# EAGLE design PDB (EAGLE 9.6.2)
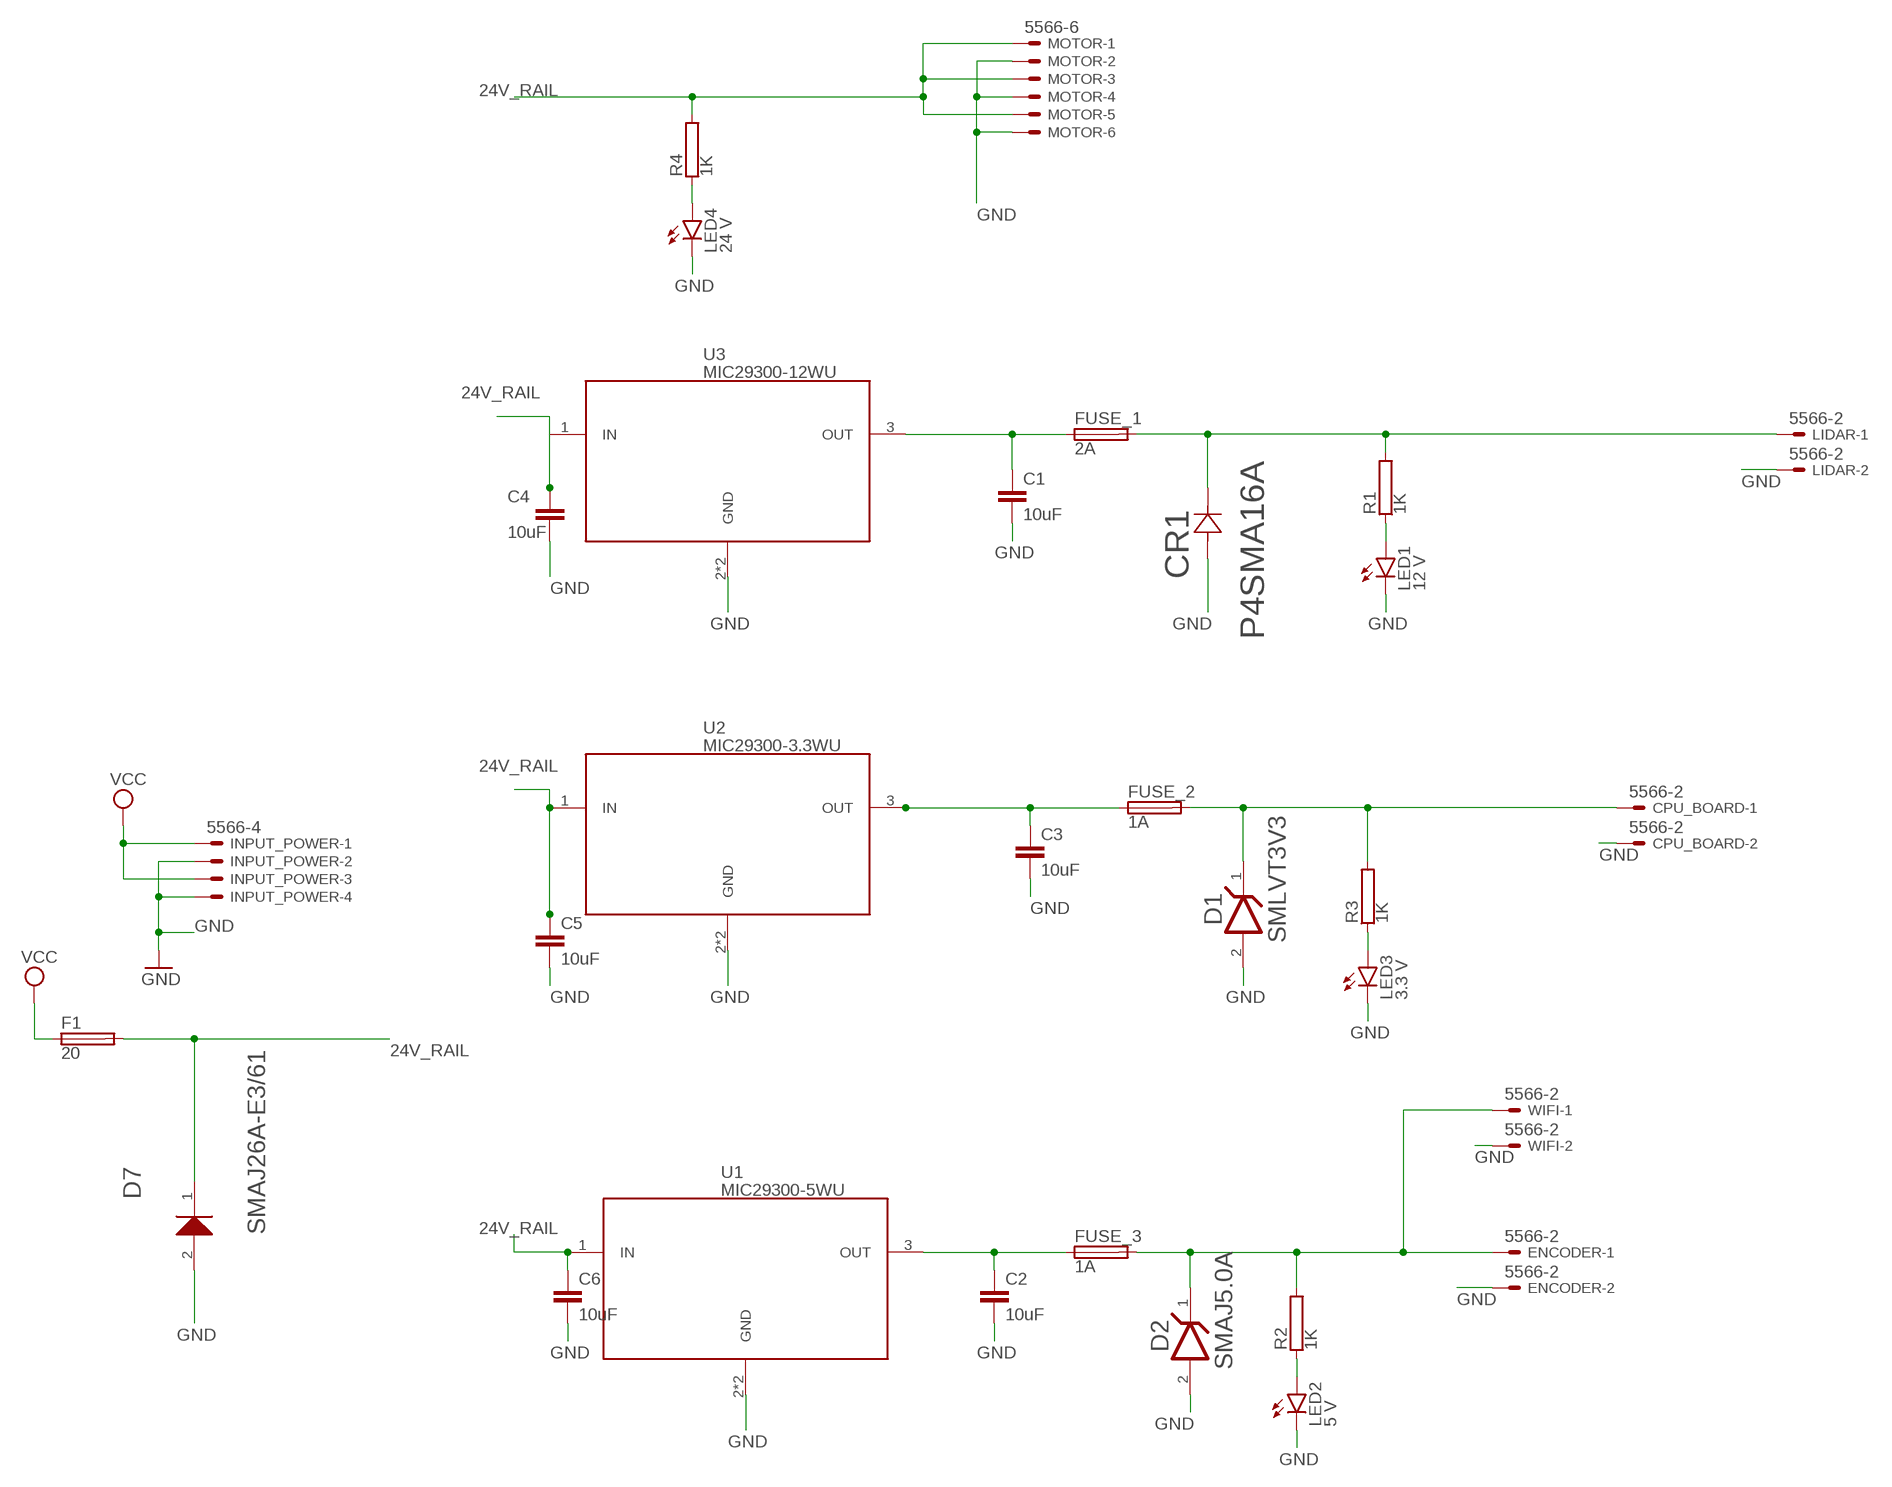
[diagram p0: schematic, sheet 1]

## Parts
C1  10uF  C2.5/2  [C2.5-2]
C2  10uF  C2.5/2  [C2.5-2]
C3  10uF  C2.5/2  [C2.5-2]
C4  10uF  C2.5/2  [C2.5-2]
C5  10uF  C2.5/2  [C2.5-2]
C6  10uF  C2.5/2  [C2.5-2]
CPU_BOARD  5566-2  [5566-2]
CR1  P4SMA16A  [P4SMASERIES_LTF]
D1  STMICROELECTRONICS_SMLVT3V3STMICROELECTRONICS_SMLVT3V3_0_0  [STMICROELECTRONICS_SMLVT3V3_0]
D2  LITTELFUSE_INC._SMAJ5.0ALITTELFUSE_INC._SMAJ5.0A_0_0  [LITTELFUSE_INC._SMAJ5.0A_0]
D7  VISHAY_SEMICONDUCTOR_SMAJ26A-E3-61VISHAY_SEMICONDUCTOR_SMAJ26A-E3-61_0_0  [VISHAY_SEMICONDUCTOR_SMAJ26A-E3-61_0]
ENCODER  5566-2  [5566-2]
F1  20  TE5  [TE5]
FUSE_1  2A  TE5  [TE5]
FUSE_2  1A  TE5  [TE5]
FUSE_3  1A  TE5  [TE5]
INPUT_POWER  5566-4  [5566-4]
LED1  12 V  LEDCHIPLED_0805  [CHIPLED_0805]
LED2  5 V  LEDCHIPLED_0805  [CHIPLED_0805]
LED3  3.3 V  LEDCHIPLED_0805  [CHIPLED_0805]
LED4  24 V  LEDCHIPLED_0805  [CHIPLED_0805]
LIDAR  5566-2  [5566-2]
MOTOR  5566-6  [5566-6]
R1  1K  RMG100-V  [TO-247-2V]
R2  1K  RMG100-V  [TO-247-2V]
R3  1K  RMG100-V  [TO-247-2V]
R4  1K  RMG100-V  [TO-247-2V]
U1  MIC29300-5WU  [TO263]
U2  MIC29300-3.3WU  [TO263]
U3  MIC29300-12WU  [TO263]
WIFI  5566-2  [5566-2]

## Nets
24V_RAIL: C4.1 C5.1 C6.1 D7.1(K) F1.2 MOTOR.1 MOTOR.3 MOTOR.5 R4.2 U1.1(IN) U2.1(IN) U3.1(IN)
GND: C1.2 C2.2 C3.2 C4.2 C5.2 C6.2 CPU_BOARD.2 CR1.2 D1.2(A) D2.2(ANODE) D7.2(A) ENCODER.2 INPUT_POWER.2 INPUT_POWER.4 LED1.C LED2.C LED3.C LED4.C LIDAR.2 MOTOR.2 MOTOR.4 MOTOR.6 U1.2(GND) U1.GND@(GND) U2.2(GND) U2.GND@(GND) U3.2(GND) U3.GND@(GND) WIFI.2
N$1: C1.1 FUSE_1.1 U3.3(OUT)
N$2: LED4.A R4.1
N$3: C2.1 FUSE_3.1 U1.3(OUT)
N$4: C3.1 FUSE_2.1 U2.3(OUT)
N$5: CPU_BOARD.1 D1.1(K) FUSE_2.2 R3.2
N$6: D2.1(CATHODE) ENCODER.1 FUSE_3.2 R2.2 WIFI.1
N$7: CR1.1 FUSE_1.2 LIDAR.1 R1.2
N$8: LED1.A R1.1
N$9: LED3.A R3.1
N$10: LED2.A R2.1
VCC: F1.1 INPUT_POWER.1 INPUT_POWER.3

## Library data of the parts
C1-C6 = capacitor-wima:C: CAPACITOR naming: grid - package width
CPU_BOARD ENCODER LIDAR WIFI = con-molex:5566-2: Mini FIT connector 2 pol Source: http://www.molex.com; MF: MOLEX; OC_FARNELL: 1822072; OC_NEWARK: unknown
CR1 = P4SMA_16A:P4SMA16A; COPYRIGHT: Copyright (C) 2022 Ultra Librarian. All rights reserved.; DIGI-KEY_PART_NUMBER_1: 283-P4SMA16ATR-ND; DIGI-KEY_PART_NUMBER_2: 2997-P4SMA16ATR-ND; DIGI-KEY_PART_NUMBER_3: P4SMA16ABBCT-ND; DIGI-KEY_PART_NUMBER_4: P4SMA16ABBDKR-ND; DIGI-KEY_PART_NUMBER_5: P4SMA16ABBTR-ND; DIGI-KEY_PART_NUMBER_6: P4SMA16ACT-ND; DIGI-KEY_PART_NUMBER_7: P4SMA16ADKR-ND; DIGI-KEY_PART_NUMBER_8: P4SMA16ATR-ND; MANUFACTURER_PART_NUMBER: P4SMA16A; MFR_NAME: Littelfuse Inc
D1 = STMicroelectronics - SMLVT3V3:STMICROELECTRONICS_SMLVT3V3: 10.3V Clamp 200A (8/20µs) Ipp Tvs Diode Surface Mount SMB (DO-214AA); AUTOMOTIVE: No; BREAKDOWN_VOLTAGE: 4.1V; CAPACITANCE: 5200pF; CENTROID_NOT_SPECIFIED: No; CLAMPING_VOLTAGE: 7.3V; DATASHEET: https://www.st.com/resource/en/datasheet/smlvt3v3.pdf; DEVICE_CLASS_L1: Circuit Protection; DEVICE_CLASS_L2: TVS Diodes; DEVICE_CLASS_L3: unset; DIGIKEY_DESCRIPTION: DIODE TVS DIODE 3.3V 10.3V SMB; DIGIKEY_PART_NUMBER: 497-2496-1-ND; DIRECTION: Unidirectional; FOOTPRINT_VARIANT_NAME_0: Recommended_Land_Pattern; HEIGHT: 2.65mm; LEAD_FREE: Yes; MAX_JUNCTION_TEMP: +175°C; MF: STMicroelectronics; MFG_PACKAGE_IDENT: SMB; MFG_PACKAGE_IDENT_DATE: 0; MFG_PACKAGE_IDENT_REV: 0; MOUSER_DESCRIPTION: TVS Diodes - Transient Voltage Suppressors 600W 3.3V Unidirect; MOUSER_PART_NUMBER: 511-SMLVT3V3; MPN: SMLVT3V3; NUMBER_OF_CHANNELS: 1; PACKAGE: SMB; PEAK_PULSE_CURRENT: 50A; PEAK_PULSE_POWER: 600W; PREFIX: D; ROHS: Yes; STANDOFF_HEIGHT: 0.05mm; TEMPERATURE_RANGE_HIGH: +175°C; TEMPERATURE_RANGE_LOW: -55°C; VERIFICATION_VERSION: 0.0.0.3
D2 = Littelfuse Inc. - SMAJ5.0A:LITTELFUSE_INC._SMAJ5.0A: Transient Voltage Suppression Diodes; CENTROID_NOT_SPECIFIED: No; CLAMPING_VOLTAGE: 9.2V; DATASHEET: http://www.littelfuse.com/~/media/electronics/datasheets/tvs_diodes/littelfuse_tvs_diode_smaj_datasheet.pdf.pdf; DEVICE_CLASS_L1: Circuit Protection; DEVICE_CLASS_L2: TVS Diodes; DEVICE_CLASS_L3: unset; DIGIKEY_DESCRIPTION: DIODE TVS DIODE 5V 9.2V DO214AC; DIGIKEY_PART_NUMBER: SMAJ5.0ALFCT-ND; DIRECTION: Unidirectional; HEIGHT: 2.29mm; LEAD_FREE: yes; MAX_JUNCTION_TEMP: +150°C; MF: Littelfuse Inc.; MFG_PACKAGE_IDENT: SMAJ; MFG_PACKAGE_IDENT_DATE: 0; MFG_PACKAGE_IDENT_REV: 0; MOUSER_DESCRIPTION: SMAJ Series 9.2 V 400 W Surface Mount Uni-Directional TVS Diode - DO-214AC; MOUSER_PART_NUMBER: 576-SMAJ5.0A; MPN: SMAJ5.0A; PACKAGE: DO-214AC; PEAK_PULSE_CURRENT: 43.5A; PREFIX: D; REVERSE_STANDOFF_VOLTAGE: 5V; ROHS: yes; STANDOFF_HEIGHT: 0.203mm; TEMPERATURE_RANGE_HIGH: +150°C; TEMPERATURE_RANGE_LOW: -65°C; VERIFICATION_VERSION: 0.0.0.1
D7 = SMAJ:VISHAY_SEMICONDUCTOR_SMAJ26A-E3-61: VISH-K1A2-2; CIIVA_IDS: 3122016; COMPONENT_LINK_1_DESCRIPTION: Manufacturer URL; COMPONENT_LINK_1_URL: http://www.vishay.com/; COMPONENT_LINK_3_DESCRIPTION: Package Specification; COMPONENT_LINK_3_URL: http://www.vishay.com/docs/88390/smaj50a.pdf; DATASHEET: http://www.vishay.com/docs/88390/smaj50a.pdf; DATASHEET_VERSION: 12/8/2013; FOOTPRINT_VARIANT_NAME_0: Level C; FOOTPRINT_VARIANT_NAME_1: Level B; FOOTPRINT_VARIANT_NAME_2: Level A; ID_UA: 1; IFSM: 40 A; IMPORTED: yes; IMPORTED_FROM: vault; IMPORT_TS: 1521861421; MF: Vishay Semiconductor; MOUNTING_TECHNOLOGY: Surface Mount; MPN: SMAJ26A-E3/61; OPERATING_JUNCTION_AND_STORAGE_TEMPERATURE_RANGE: -55 to 150 degC; PACKAGE: DO-214AC-2; PACKAGE_DESCRIPTION: 2-Pin DO-214AC (SMA), Body 4.245 x 2.665 mm; PACKING: Tape and Reel; PPPM_W: 400, 300; PREFIX: D; RELEASE_DATE: 1384933640; ROHS: Yes; VAULT_GUID: AD317694-DE0E-4C26-89D2-23B1414C378E; VAULT_REVISION: 6B730A9C-908D-494C-BC28-14F9434F73E3; VBR_UNI_DIRECTIONAL_V: 6.4 to 231; VWM_V: 26
F1 FUSE_1-FUSE_3 = fuse:TE5: FUSE Wickmann; OC_FARNELL: unknown; OC_NEWARK: unknown
INPUT_POWER = con-molex:5566-4: Mini FIT connector 4 pol Source: http://www.molex.com; MF: MOLEX; OC_FARNELL: unknown; OC_NEWARK: unknown
LED1-LED4 = led:LED: LED OSRAM: - CHIPLED LG R971, LG N971, LY N971, LG Q971, LY Q971, LO R971, LY R971 LH N974, LH R974 LS Q976, LO Q976, LY Q976 LO Q996 - Hyper CHIPLED LW Q18S LB Q993, LB Q99A, LB R99A - SideLED LS A670, LO A670, LY A670, LG A670, LP A670 LB A673, LV A673, LT A673, LW A673 LH A674 LY A675 LS A676, LA A676, LO A676, LY A676, LW A676 LS A679, LY A679, LG A679 - Hyper Micro SIDELED® LS Y876, LA Y876, LO Y876, LY Y876 LT Y87S - SmartLED LW L88C, LW L88S LB L89C, LB L89S, LG L890 LS L89K, LO L89K, LY L89K LS L896, LA L896, LO L896, LY L896 - TOPLED LS T670, LO T670, LY T670, LG T670, LP T670 LSG T670, LSP T670, LSY T670, LOP T670, LYG T670 LG T671, LOG T671, LSG T671 LB T673, LV T673, LT T673, LW T673 LH T674 LS T676, LA T676, LO T676, LY T676, LB T676, LH T676, LSB T676, LW T676 LB T67C, LV T67C, LT T67C, LS T67K, LO T67K, LY T67K, LW E67C LS E67B, LA E67B, LO E67B, LY E67B, LB E67C, LV E67C, LT E67C LW T67C LS T679, LY T679, LG T679 LS T770, LO T770, LY T770, LG T770, LP T770 LB T773, LV T773, LT T773, LW T773 LH T774 LS E675, LA E675, LY E675, LS T675 LS T776, LA T776, LO T776, LY T776, LB T776 LHGB T686 LT T68C, LB T68C - Hyper Mini TOPLED® LB M676 - Mini TOPLED Santana® LG M470 LS M47K, LO M47K, LY M47K Source: http://www.osram.convergy.de LUXEON: - LUMILED® LXK2-PW12-R00, LXK2-PW12-S00, LXK2-PW14-U00, LXK2-PW14-V00 LXK2-PM12-R00, LXK2-PM12-S00, LXK2-PM14-U00 LXK2-PE12-Q00, LXK2-PE12-R00, LXK2-PE12-S00, LXK2-PE14-T00, LXK2-PE14-U00 LXK2-PB12-K00, LXK2-PB12-L00, LXK2-PB12-M00, LXK2-PB14-N00, LXK2-PB14-P00, LXK2-PB14-Q00 LXK2-PR12-L00, LXK2-PR12-M00, LXK2-PR14-Q00, LXK2-PR14-R00 LXK2-PD12-Q00, LXK2-PD12-R00, LXK2-PD12-S00 LXK2-PH12-R00, LXK2-PH12-S00 LXK2-PL12-P00, LXK2-PL12-Q00, LXK2-PL12-R00 Source: www.luxeon.com KINGBRIGHT: KA-3528ASYC Source: www.kingbright.com
MOTOR = con-molex:5566-6: Mini FIT connector 6 pol Source: http://www.molex.com; MF: MOLEX; MPN: 95566-61002; OC_FARNELL: unknown; OC_NEWARK: 22K8620
R1-R4 = resistor-power:RMG100: TO-247 Power Resistor - RMG 100 Series Source: www.token.com.tw .. power-resistor-rmg100pdf; OC_FARNELL: unknown; OC_NEWARK: unknown
U1 = MIC29300:MIC29300-5WU: Check availability <https://pricing.snapeda.com/parts/MIC29300-12WU/Microchip%20Technology/view-part?ref=eda>; AVAILABILITY: In Stock; DESCRIPTION: Linear Voltage Regulator IC Positive Fixed 1 Output 3A TO-263-3; MF: Microchip Technology; MP: MIC29300-5WU; PACKAGE: None; PRICE: None; PURCHASE-URL: https://pricing.snapeda.com/search/part/MIC29300-12WU/?ref=eda
U2 = MIC29300:MIC29300-3.3WU: Check availability <https://pricing.snapeda.com/parts/MIC29300-12WU/Microchip%20Technology/view-part?ref=eda>; AVAILABILITY: In Stock; DESCRIPTION: Linear Voltage Regulator IC Positive Fixed 1 Output 3A TO-263-3; MF: Microchip Technology; MP: MIC29300-3.3WU; PACKAGE: None; PRICE: None; PURCHASE-URL: https://pricing.snapeda.com/search/part/MIC29300-12WU/?ref=eda
U3 = MIC29300:MIC29300-12WU: Check availability <https://pricing.snapeda.com/parts/MIC29300-12WU/Microchip%20Technology/view-part?ref=eda>; AVAILABILITY: In Stock; DESCRIPTION: Linear Voltage Regulator IC Positive Fixed 1 Output 3A TO-263-3; MF: Microchip Technology; MP: MIC29300-12WU; PACKAGE: None; PRICE: None; PURCHASE-URL: https://pricing.snapeda.com/search/part/MIC29300-12WU/?ref=eda

## Board
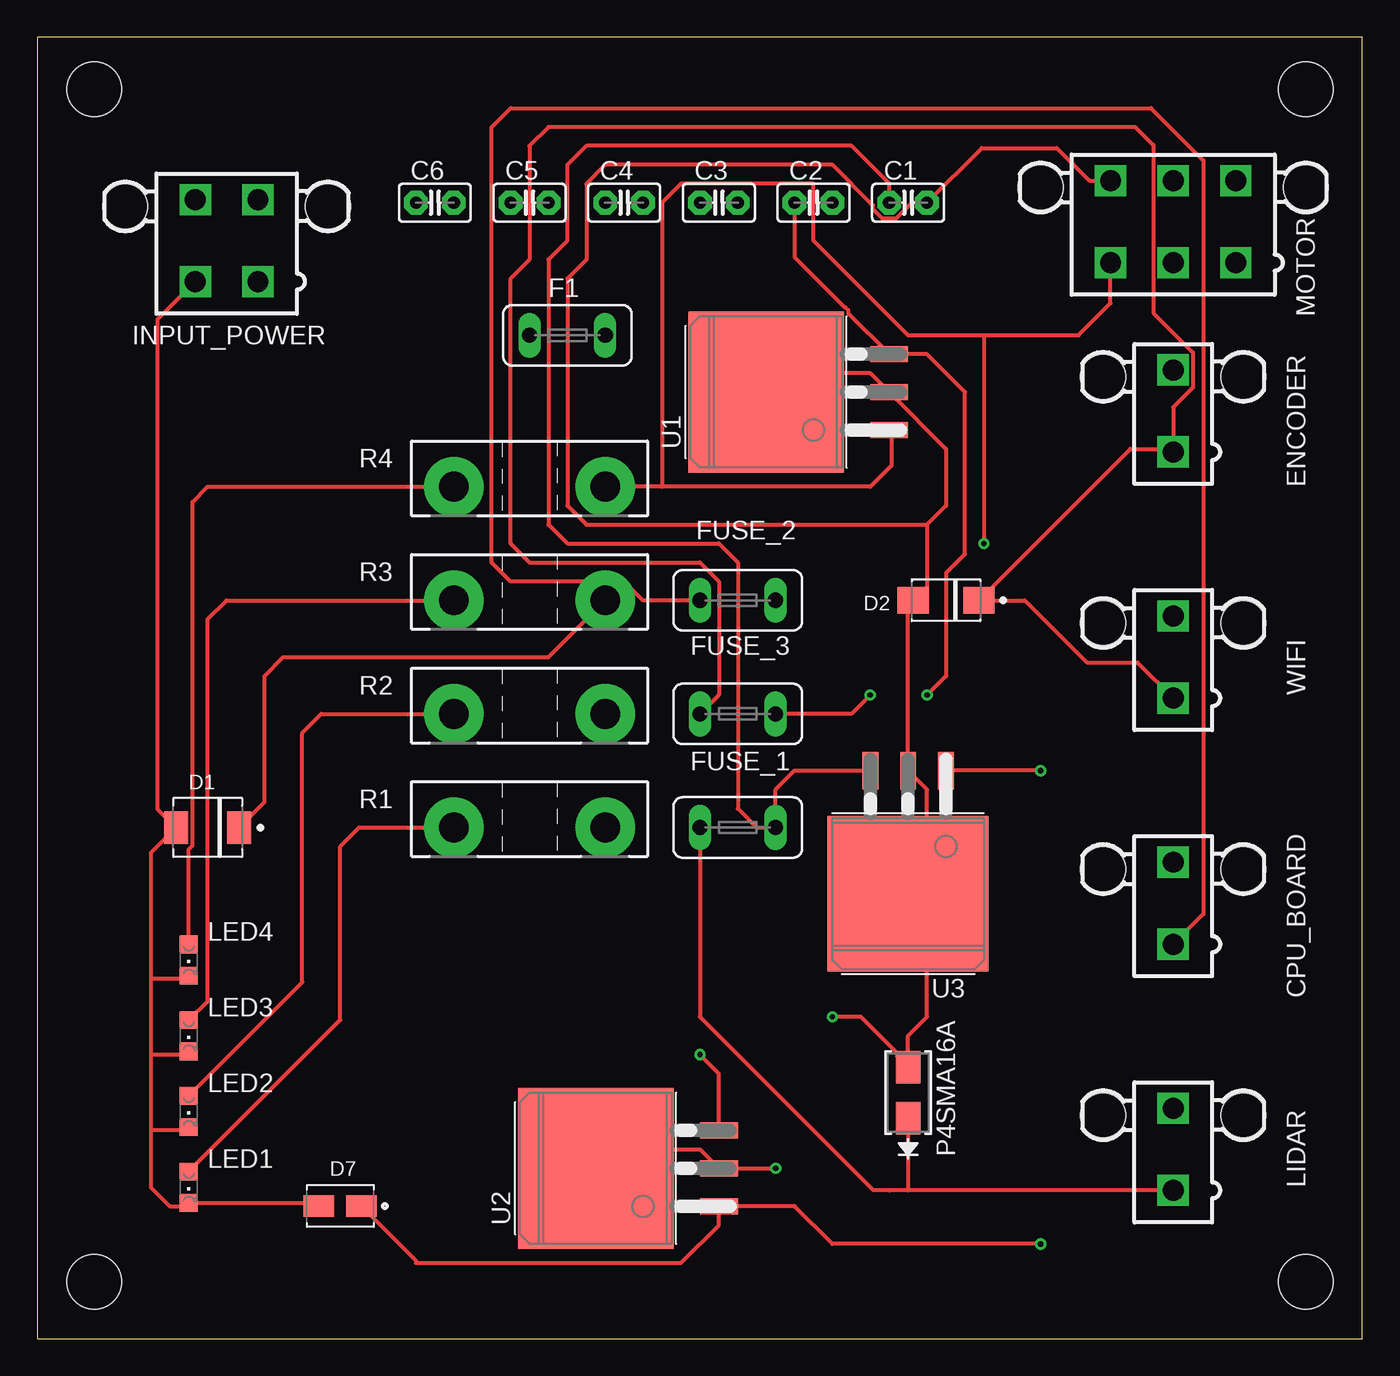
[diagram p1: board, top side]
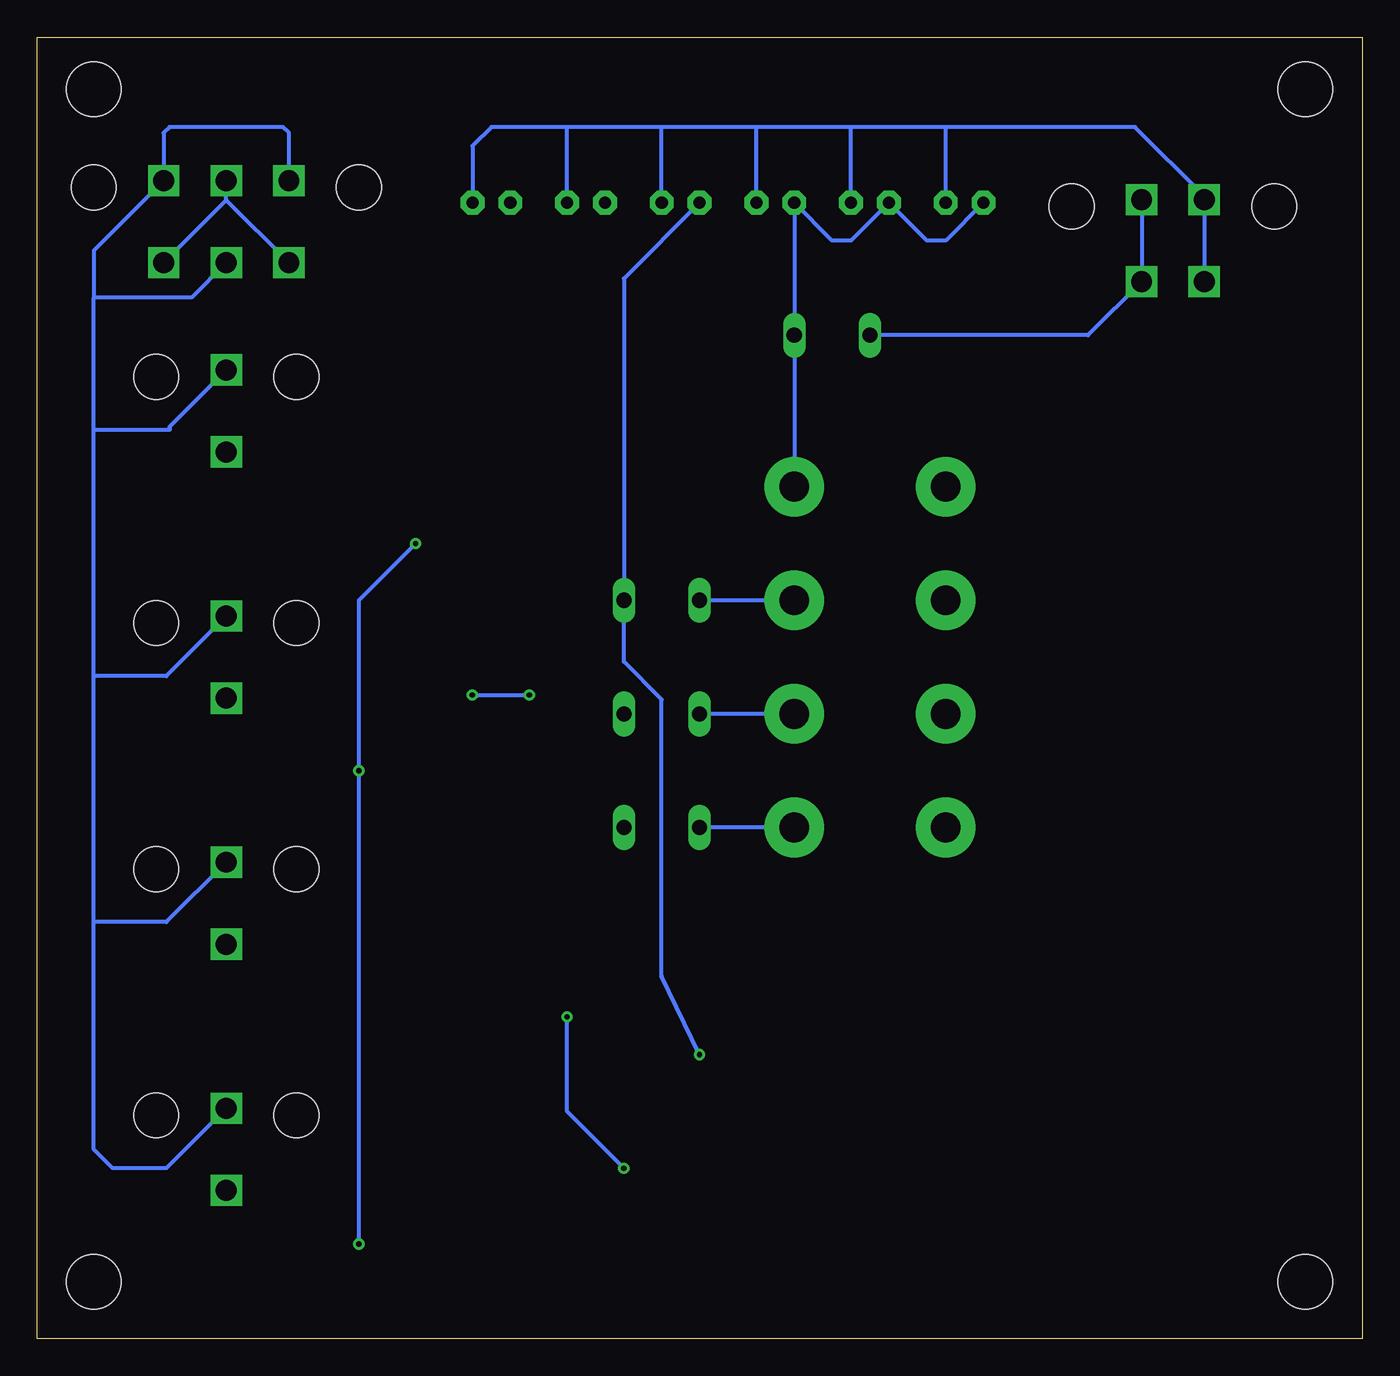
[diagram p2: board, bottom side, seen from below]

Size 88.88 x 87.3 mm. Coordinates in mm from the lower left corner, seen from the top.
Outline: 0,0 88.88,0 88.88,87.3 0,87.3 0,0
Copper layers (1*16): Top 0.035mm / dielectric 1.5mm / Bottom 0.035mm
Design rules "default": minimum track width 6mil, minimum drill 0.35mm, track to track 6mil, track to pad 6mil, pad to pad 6mil, via to via 6mil, smd to smd 6mil, copper to edge 40mil, drill to drill 6mil, minimum pad ring 10mil, minimum via ring 8mil, stop-mask expansion 4mil, vias tented up to drill 0mil, thermal gap 10mil
Holes 3.66 mm at 3.81,3.81 3.81,83.82 85.09,83.82 85.09,3.81

### Footprints (pad centres in the part's own frame; a part is rotated, then mirrored left to right if it is on the bottom)
C2.5-2 = drill 0.813 pad 1.6 octagon: 1 -1.27,0; 2 1.27,0
5566-2 = drill 1.4 square: 1 0,-2.75; 2 0,2.75 | hole 3: 4.7,2.29; -4.7,2.29
P4SMASERIES_LTF = smd 2.184 x 1.651: 1 -1.702,0; 2 1.702,0
STMICROELECTRONICS_SMLVT3V3_0 = smd 1.62 x 2.18: 1 -2.11,0; 2 2.11,0
LITTELFUSE_INC._SMAJ5.0A_0 = smd 2.1 x 1.8: 1 -2.2,0; 2 2.2,0
VISHAY_SEMICONDUCTOR_SMAJ26A-E3-61_0 = smd 2.05 x 1.45: 1 -1.425,0; 2 1.425,0
TE5 = drill 1.016 long: 1 -2.54,0; 2 2.54,0
5566-4 = drill 1.4 square: 1 2.1,-2.75; 2 -2.1,-2.75; 3 2.1,2.75; 4 -2.1,2.75 | hole 3: 6.8,2.29; -6.8,2.29
CHIPLED_0805 = smd 1.2 x 1.2: A 0,-1.05; C 0,1.05
5566-6 = drill 1.4 square: 1 4.2,-2.75; 2 0,-2.75; 3 -4.2,-2.75; 4 4.2,2.75; 5 0,2.75; 6 -4.2,2.75 | hole 3: 8.9,2.29; -8.9,2.29
TO-247-2V = drill 2 pad 4: 1 -5.08,0; 2 5.08,0
TO263 = smd 1.067 x 2.54: 1 -2.54,0; 2 0,0; 3 2.54,0 | smd 10.795 x 10.414: GND@ 0,8.255

### Placement (x,y rotation side)
C1  58.42,76.2 0 top
C2  52.07,76.2 0 top
C3  45.72,76.2 0 top
C4  39.37,76.2 0 top
C5  33.02,76.2 0 top
C6  26.67,76.2 0 top
CPU_BOARD  76.2,29.21 0 top
CR1  58.42,16.51 90 top
D1  11.43,34.29 180 top
D2  60.96,49.53 180 top
D7  20.32,8.89 180 top
ENCODER  76.2,62.23 0 top
F1  35.56,67.31 0 top
FUSE_1  46.99,34.29 180 top
FUSE_2  46.99,49.53 180 top
FUSE_3  46.99,41.91 180 top
INPUT_POWER  12.7,73.66 0 top
LED1  10.16,10.16 180 top
LED2  10.16,15.24 180 top
LED3  10.16,20.32 180 top
LED4  10.16,25.4 180 top
LIDAR  76.2,12.7 0 top
MOTOR  76.2,74.93 0 top
R1  33.02,34.29 0 top
R2  33.02,41.91 0 top
R3  33.02,49.53 0 top
R4  33.02,57.15 0 top
U1  57.15,63.5 90 top
U2  45.72,11.43 90 top
U3  58.42,38.1 180 top
WIFI  76.2,45.72 0 top

### Tracks (layer width: path | path; a pad name or v marks a point on that pad's centre or on a via)
24V_RAIL  (via drill 0.35)
  Top 0.254: 41.91,57.15 55.88,57.15 57.31,58.59 57.31,60.8 U1.1 | 41.91,57.15 R4.2 | 63.5,67.31 v63.5,53.34 | 63.5,67.31 58.42,67.31 52.07,73.66 52.07,77.47 43.18,77.47 41.91,76.2 41.91,57.15 | 63.5,67.31 69.85,67.31 72,69.46 MOTOR.3 | D7.1 25.4,5.24 25.4,5.08 43.18,5.08 45.72,7.62 U2.1 50.8,8.89 53.34,6.35 v67.31,6.35 | v67.31,38.1 U3.1
  Bottom 0.254: MOTOR.1 76.2,76.38 | 76.2,76.38 MOTOR.5 | MOTOR.3 76.2,76.38 | R4.2 F1.2 C4.1 35.56,73.66 34.29,73.66 C5.1 29.21,73.66 27.94,73.66 C6.1 | v63.5,53.34 67.31,49.53 v67.31,38.1 v67.31,6.35
GND  (via drill 0.35)
  Top 0.254: INPUT_POWER.2 8.06,68.37 8.06,35.55 D1.2 7.62,32.59 7.62,24.13 | 7.62,13.97 7.62,10.16 8.89,8.89 9.94,8.89 LED1.C 18.68,9.11 D7.2 | 7.62,24.13 7.62,19.05 | 7.62,19.05 7.62,13.97 | LED2.C 9.94,13.97 7.62,13.97 | LED3.C 9.94,19.05 7.62,19.05 | LED4.C 9.94,24.13 7.62,24.13 | 59.69,54.61 60.96,55.88 60.96,59.69 U1.2 55.88,64.77 50.16,64.77 U1.GND@ | 59.69,54.61 59.69,50.46 D2.2 58.42,49.19 U3.2 59.69,36.83 59.69,30.48 | 59.69,54.61 36.83,54.61 35.56,55.88 35.56,71.12 36.83,72.39 36.83,77.47 38.1,78.74 53.34,78.74 56.07,76.01 56.07,75.75 56.7,75.12 57.6,75.12 58.68,76.2 C1.2 63.35,79.86 68.39,79.86 70.58,77.68 MOTOR.6 | 59.69,30.48 59.69,21.59 58.42,20.32 CR1.2 57.68,18.95 57.68,19.16 55.25,21.59 v53.34,21.59 | U3.GND@ 59.05,30.48 59.69,30.48 | v49.53,11.43 U2.2 44.45,12.7 38.1,12.7 38.1,12.06 U2.GND@
  Bottom 0.254: MOTOR.6 72,80.89 72.39,81.28 80.01,81.28 80.4,80.89 MOTOR.4 85.09,72.99 85.09,69.85 | MOTOR.2 78.53,69.85 85.09,69.85 | 85.09,60.96 85.09,69.85 | WIFI.2 80.22,44.45 85.09,44.45 | 85.09,44.45 85.09,60.96 | CPU_BOARD.2 80.22,27.94 85.09,27.94 | 85.09,27.94 85.09,44.45 | LIDAR.2 80.22,11.43 83.82,11.43 85.09,12.7 85.09,27.94 | 27.94,81.28 15.24,81.28 10.6,76.64 INPUT_POWER.4 INPUT_POWER.2 | 27.94,81.28 34.29,81.28 | 34.29,81.28 40.64,81.28 | 40.64,81.28 46.99,81.28 | 46.99,81.28 53.34,81.28 | 53.34,81.28 58.42,81.28 59.69,80.01 C1.2 | C2.2 53.34,81.28 | C3.2 46.99,81.28 | C4.2 40.64,81.28 | C5.2 34.29,81.28 | C6.2 27.94,81.28 | ENCODER.2 80.01,61.17 80.01,60.96 85.09,60.96 | v49.53,11.43 53.34,15.24 v53.34,21.59
N$1
  Top 0.254: U3.3 50.8,38.1 49.53,36.83 FUSE_1.1 48.26,34.29 46.99,35.56 46.99,52.07 45.72,53.34 35.56,53.34 34.29,54.61 34.29,72.39 35.56,73.66 35.56,78.74 36.83,80.01 54.61,80.01 57.15,77.47 C1.1
N$2
  Top 0.254: LED4.A 10.16,32.84 10.41,33.08 10.41,56.13 11.43,57.15 R4.1
N$3  (via drill 0.35)
  Top 0.254: C2.1 50.8,72.56 54.18,69.18 54.22,69.18 54.38,69.01 54.38,68.81 U1.3 59.69,66.04 62.23,63.5 62.23,52.65 60.96,51.38 60.96,44.45 v59.69,43.18 | v55.88,43.18 54.61,41.91 FUSE_3.1
  Bottom 0.254: v59.69,43.18 v55.88,43.18
N$4  (via drill 0.35)
  Top 0.254: v44.45,19.05 45.72,17.78 U2.3
  Bottom 0.254: C3.1 49.53,71.12 FUSE_2.1 49.53,45.41 46.99,42.88 46.99,24.31 v44.45,19.05
N$5
  Top 0.254: D1.1 15.24,35.99 15.24,44.45 16.51,45.72 34.29,45.72 R3.2 | FUSE_2.2 40.64,49.53 39.37,50.8 31.75,50.8 30.48,52.07 30.48,81.28 31.75,82.55 74.7,82.55 78.22,79.03 78.22,28.48 CPU_BOARD.1
  Bottom 0.254: R3.2 FUSE_2.2
N$6
  Top 0.254: FUSE_3.2 45.72,43.18 45.72,50.8 44.45,52.07 33.02,52.07 31.75,53.34 31.75,71.12 33.02,72.39 33.02,80.01 34.29,81.28 73.66,81.28 74.87,80.07 74.87,68.81 77.53,66.15 77.53,63.81 76.2,62.48 76.2,59.69 | 76.2,59.69 ENCODER.1 | 76.2,59.69 73.32,59.69 D2.1 66.24,49.53 70.41,45.37 73.8,45.37 WIFI.1
  Bottom 0.254: R2.2 FUSE_3.2
N$7
  Top 0.254: FUSE_1.2 44.45,21.59 56.07,9.97 57.15,9.97 57.17,9.95 58.42,9.95 | LIDAR.1 58.42,9.95 | CR1.1 58.42,9.95
  Bottom 0.254: R1.2 FUSE_1.2
N$8
  Top 0.254: LED1.A 20.32,21.37 20.32,33.02 21.59,34.29 R1.1
N$9
  Top 0.254: LED3.A 11.43,22.64 11.43,48.26 12.7,49.53 R3.1
N$10
  Top 0.254: LED2.A 17.78,23.91 17.78,40.64 19.05,41.91 R2.1
VCC
  Bottom 0.254: INPUT_POWER.3 INPUT_POWER.1 18.4,67.31 F1.1